# EAGLE design attiny2313devbd (EAGLE 5.06)
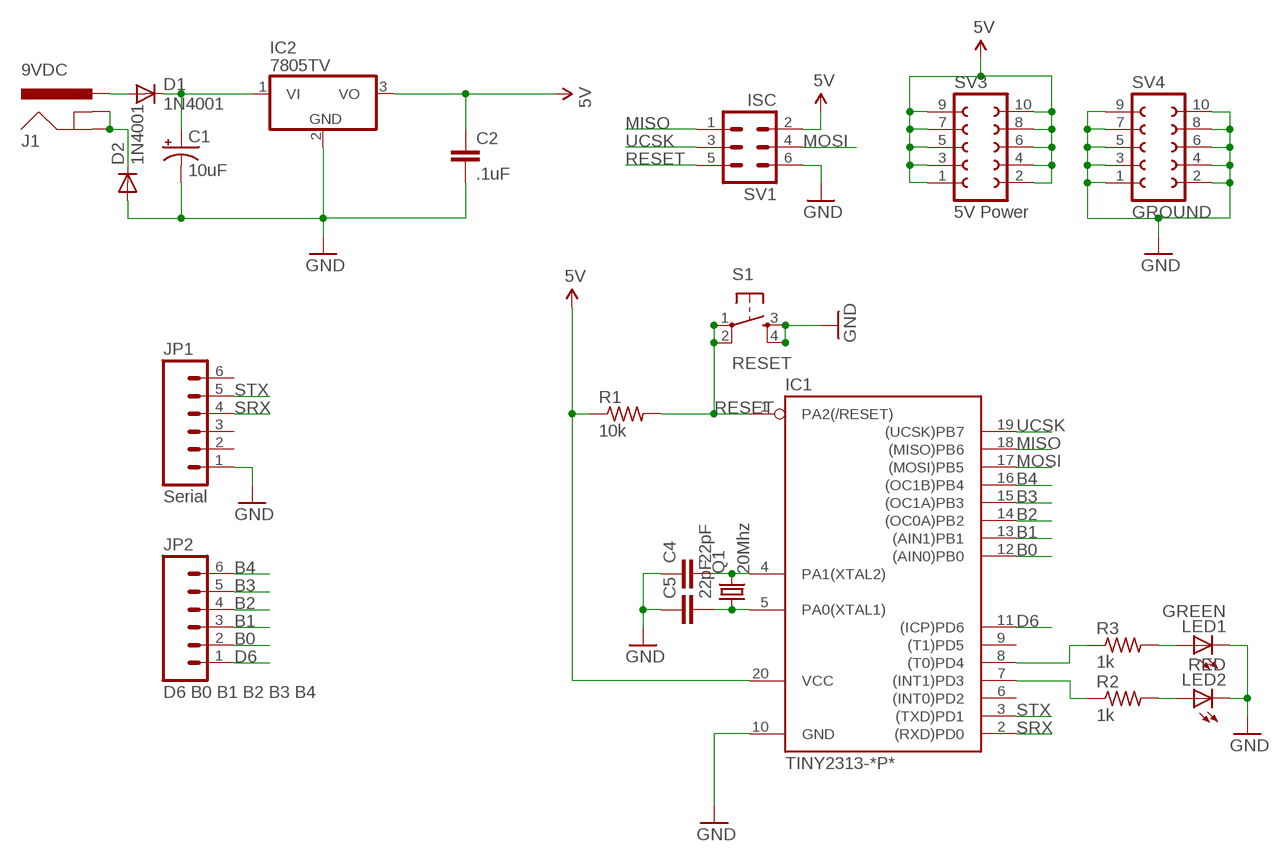
[diagram p0: schematic, sheet 1]

## Parts
C1  10uF  CAP_POLPTH2  [CPOL-RADIAL-10UF-25V]
C2  .1uF  CAPPTH2  [CAP-PTH-SMALL2]
C4  22pF  CAPPTH2  [CAP-PTH-SMALL2]
C5  22pF  CAPPTH2  [CAP-PTH-SMALL2]
D1  1N4001  DIODEPTH  [DIODE-1N4001]
D2  1N4001  DIODEPTH  [DIODE-1N4001]
IC1  TINY2313-*P*  [DIL20]
IC2  7805TV  [TO220V]
J1  9VDC  POWER_JACKPTH  [POWER_JACK_PTH]
JP1  Serial  M06SIP  [1X06]
JP2  D6 B0 B1 B2 B3 B4  M06FEMALE_LOCK  [1X06_FEMALE_LOCK.010]
LED1  GREEN  LED3MM  [LED3MM]
LED2  RED  LED3MM  [LED3MM]
Q1  20Mhz  CRYSTALHC49UV  [HC49U-V]
R1  10k  R-US_0207/10  [0207/10]
R2  1k  R-US_0207/10  [0207/10]
R3  1k  R-US_0207/10  [0207/10]
S1  RESET  TAC_SWITCHPTH  [TACTILE-PTH]
SV1  ISC  ML6  [ML6]
SV3  5V Power  FE05-2  [FE05-2]
SV4  GROUND  FE05-2  [FE05-2]

## Nets
5V: C2.1 IC1.20(VCC) IC2.3(VO) R1.1 SV1.2 SV3.1 SV3.2 SV3.3 SV3.4 SV3.5 SV3.6 SV3.7 SV3.8 SV3.9 SV3.10
B0: IC1.12((AIN0)PB0) JP2.2
B1: IC1.13((AIN1)PB1) JP2.3
B2: IC1.14((OC0A)PB2) JP2.4
B3: IC1.15((OC1A)PB3) JP2.5
B4: IC1.16((OC1B)PB4) JP2.6
D6: IC1.11((ICP)PD6) JP2.1
GND: C1.2(-) C2.2 C4.1 C5.1 D2.A IC1.10(GND) IC2.2(GND) JP1.1 LED1.K(C) LED2.K(C) S1.3 S1.4 SV1.6 SV4.1 SV4.2 SV4.3 SV4.4 SV4.5 SV4.6 SV4.7 SV4.8 SV4.9 SV4.10
MISO: IC1.18((MISO)PB6) SV1.1
MOSI: IC1.17((MOSI)PB5) SV1.4
N$1: D1.A J1.PWR
N$2: C1.1(+) D1.C IC2.1(VI)
N$3: D2.C J1.GND J1.GNDBREAK
N$4: IC1.8((T0)PD4) R3.1
N$5: IC1.7((INT1)PD3) R2.1
N$6: C4.2 IC1.4(PA1(XTAL2)) Q1.2
N$7: C5.2 IC1.5(PA0(XTAL1)) Q1.1
N$8: LED2.A R2.2
N$9: LED1.A R3.2
RESET: IC1.1(PA2(/RESET)) R1.2 S1.1 S1.2 SV1.5
SRX: IC1.2((RXD)PD0) JP1.4
STX: IC1.3((TXD)PD1) JP1.5
UCSK: IC1.19((UCSK)PB7) SV1.3
Unconnected: IC1.6((INT0)PD2) IC1.9((T1)PD5) JP1.2 JP1.3 JP1.6

## Library data of the parts
C1 = SparkFun:CAP_POL: Capacitor Polarized These are standard SMD and PTH capacitors. Normally 10uF, 47uF, and 100uF in electrolytic and tantalum varieties. Always verify the external diameter of the through hole cap, it varies with capacity, voltage, and manufacturer. The EIA devices should be standard.
C2 C4 C5 = SparkFun:CAP: Capacitor Standard 0603 ceramic capacitor, and 0.1" leaded capacitor.
D1 D2 = SparkFun:DIODE: Diode These are standard reverse protection diodes and small signal diodes. SMA package can handle up to about 1A. SOD-323 can handle about 200mA. What the SOD-323 package when ordering, there are some mfgs out there that are 5-pin packages.
IC1 = avr-6:TINY2313*: Atmel Tiny2313 2K Flash, 128 bytes EEPROM, 128 bytes RAM
IC2 = linear:78*: Positive VOLTAGE REGULATOR Source: http://cache.national.com/ds/LM/LM78L05.pdf http://www.fairchildsemi.com/ds/LM/LM7805.pdf
J1 = SparkFun:POWER_JACK: Power Jack This is the standard 5.5mm barrel jack for power. The PTH is the most common, proven, reliable, footprint. All others are experimental. The Slot footprint only works if the mill layer is transmitted to the PCB fab house so be warned. Spark Fun Electronics SKU : PRT-00119. Mating wall wart : TOL-00298 (and others)
JP1 JP2 = SparkFun:M06: Header 6 Standard 6-pin 0.1" header. Use with straight break away headers (SKU : PRT-00116), right angle break away headers (PRT-00553), swiss pins (PRT-00743), machine pins (PRT-00117), and female headers (PRT-00115). Molex polarized connector foot print use with SKU : PRT-08094 with associated crimp pins and housings. NOTES ON THE VARIANTS LOCK and LOCK_LONGPADS... This footprint was designed to help hold the alignment of a through-hole component (i.e. 6-pin header) while soldering it into place. You may notice that each hole has been shifted either up or down by 0.005 of an inch from it's more standard position (which is a perfectly straight line). This slight alteration caused the pins (the squares in the middle) to touch the edges of the holes. Because they are alternating, it causes a "brace" to hold the component in place. 0.005 has proven to be the perfect amount of "off-center" position when using our standard breakaway headers. Although looks a little odd when you look at the bare footprint, once you have a header in there, the alteration is very hard to notice. Also, if you push a header all the way into place, it is covered up entirely on the bottom side. This idea of altering the position of holes to aid alignment will be further integrated into the Sparkfun Library for other footprints. It can help hold any component with 3 or more connection pins.
LED1 LED2 = SparkFun:LED: LEDs Standard schematic elements and footprints for 5mm, 3mm, 1206, and 0603 sized LEDs. 5mm - Spark Fun Electronics SKU : COM-00529 (and others)
Q1 = SparkFun:CRYSTAL: Crystals Various standard crystals. Proven footprints. Spark Fun Electronics SKU : COM-00534
R1-R3 = resistor:R-US_: RESISTOR, American symbol
S1 = SparkFun:TAC_SWITCH: Momentary Switch Button commonly used for reset or general input. Spark Fun Electronics SKU : COM-00097
SV1 = con-harting-ml:ML6: HARTING
SV3 SV4 = con-lsta:FE05-2: FEMALE HEADER

## Board
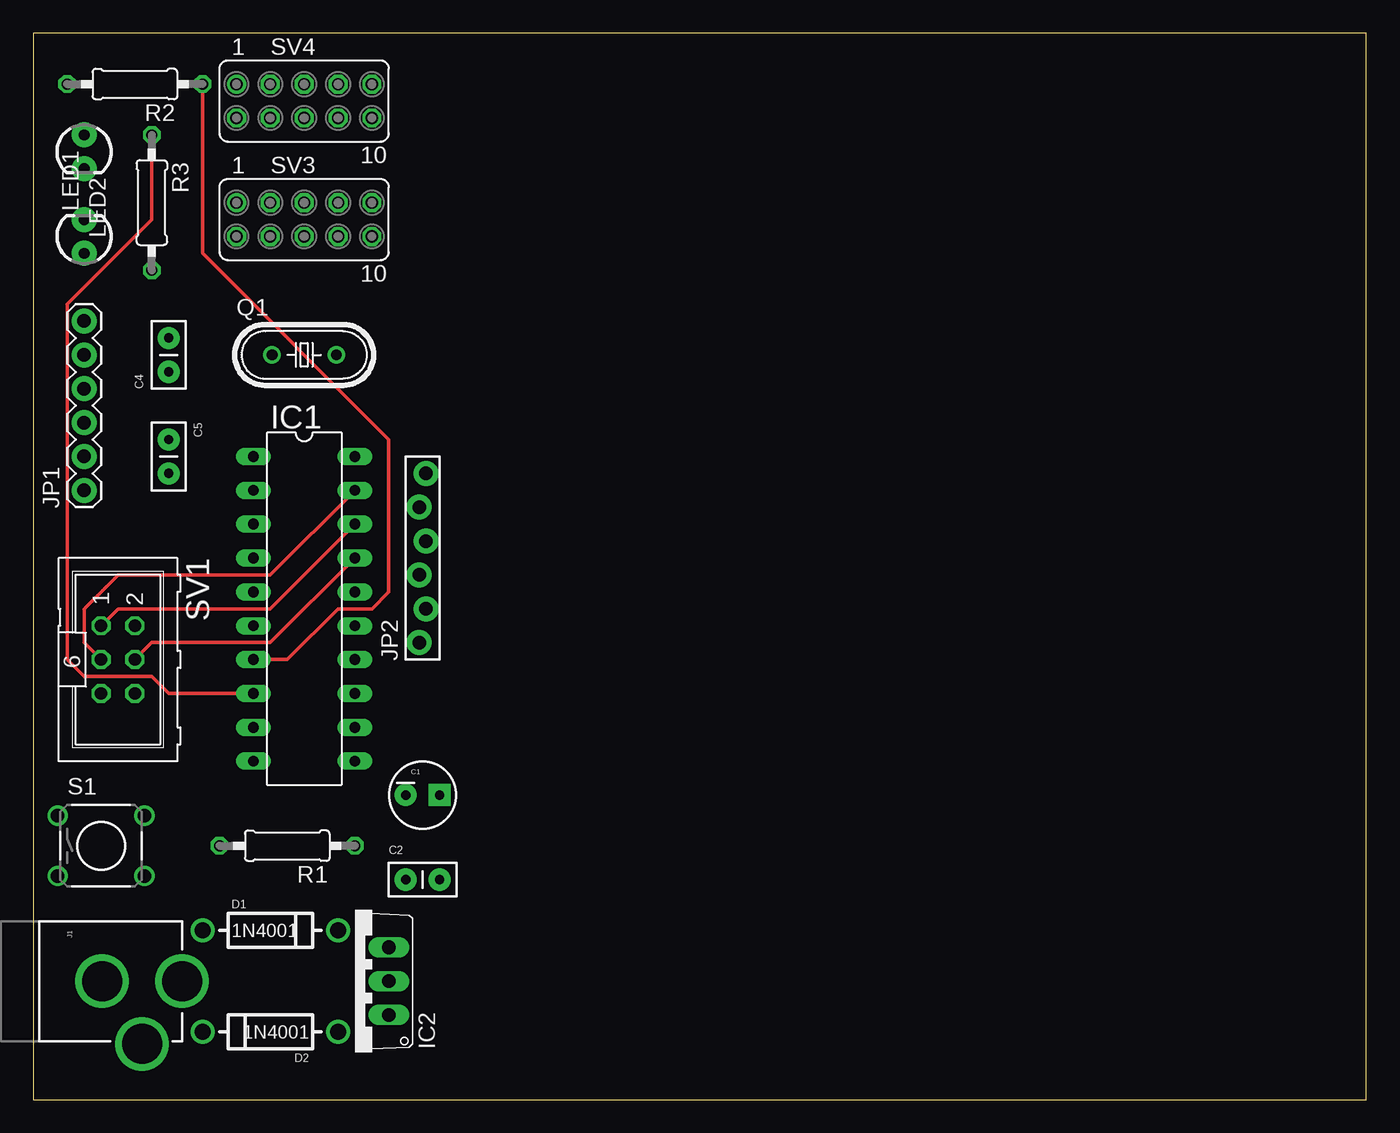
[diagram p1: board, top side]
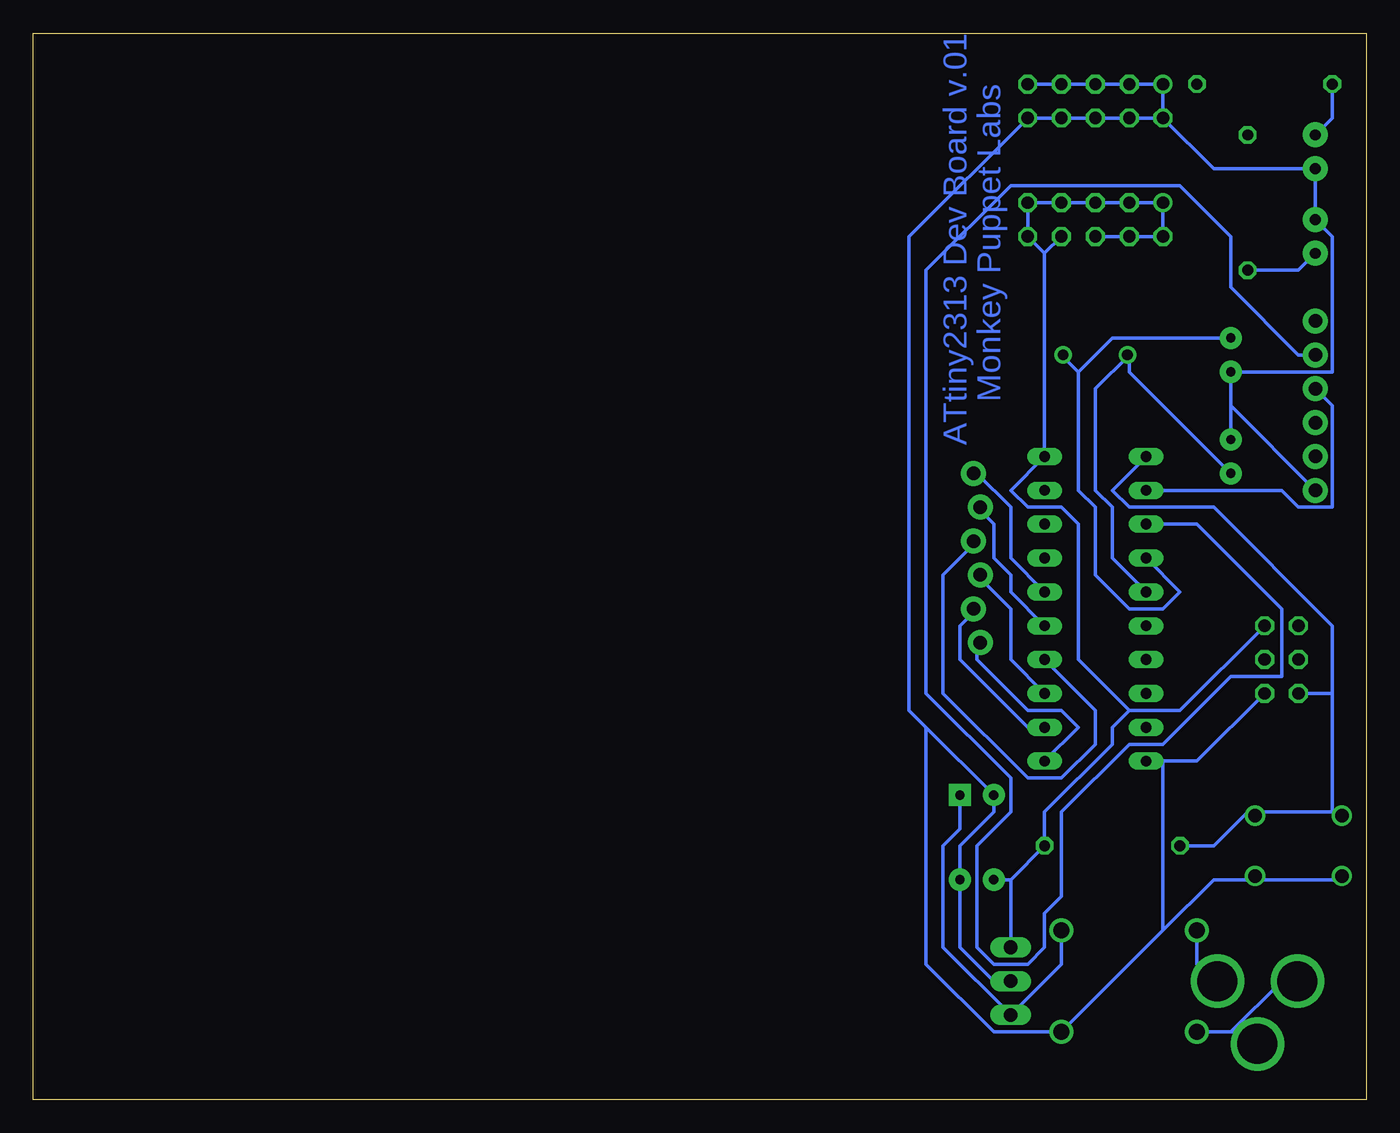
[diagram p2: board, bottom side, seen from below]

Size 100 x 80 mm. Coordinates in mm from the lower left corner, seen from the top.
Outline: 0,0 100,0 100,80 0,80 0,0
Copper layers (1*16): Top 0.035mm / dielectric 1.5mm / Bottom 0.035mm
Design rules "default": minimum track width 10mil, minimum drill 24mil, track to track 8mil, track to pad 8mil, pad to pad 8mil, via to via 8mil, smd to smd 8mil, copper to edge 40mil, drill to drill 8mil, minimum pad ring 10mil, minimum via ring 8mil, stop-mask expansion 4mil, vias tented up to drill 0mil, thermal gap 10mil

### Footprints (pad centres in the part's own frame; a part is rotated, then mirrored left to right if it is on the bottom)
CPOL-RADIAL-10UF-25V = drill 0.7 pad 1.651 square: 1 1.27,0 | drill 0.7 pad 1.651 round: 2 -1.27,0
CAP-PTH-SMALL2 = drill 0.7 pad 1.651 round: 1 0,0; 2 2.54,0
DIODE-1N4001 = drill 1.2 round: A -5.08,0; C 5.08,0
DIL20 = drill 0.813 long: 1 -11.43,-3.81; 2 -8.89,-3.81; 3 -6.35,-3.81; 4 -3.81,-3.81; 5 -1.27,-3.81; 6 1.27,-3.81; 7 3.81,-3.81; 8 6.35,-3.81; 9 8.89,-3.81; 10 11.43,-3.81; 11 11.43,3.81; 12 8.89,3.81; 13 6.35,3.81; 14 3.81,3.81; 15 1.27,3.81; 16 -1.27,3.81; 17 -3.81,3.81; 18 -6.35,3.81; 19 -8.89,3.81; 20 -11.43,3.81
TO220V = drill 1.016 long: 1 -2.54,-2.54; 2 0,-2.54; 3 2.54,-2.54
POWER_JACK_PTH = drill 2.997 round: GND 0,7.7; GNDBREAK 4.7,10.7; PWR 0,13.7
1X06 = drill 1.016 pad 1.88 round: 1 0,0; 2 2.54,0; 3 5.08,0; 4 7.62,0; 5 10.16,0; 6 12.7,0
1X06_FEMALE_LOCK.010 = drill 1.016 pad 1.88 round: 1 0,0.254; 2 2.54,-0.254; 3 5.08,0.254; 4 7.62,-0.254; 5 10.16,0.254; 6 12.7,-0.254
LED3MM = drill 0.813 pad 1.88 round: A -1.27,0; K 1.27,0
HC49U-V = drill 0.813 round: 1 -2.413,0; 2 2.413,0
0207/10 = drill 0.813 octagon: 1 -5.08,0; 2 5.08,0
TACTILE-PTH = drill 1.016 round: 1 -3.251,2.261; 2 3.251,2.261; 3 -3.251,-2.261; 4 3.251,-2.261
ML6 = drill 0.914 octagon: 1 -2.54,-1.27; 2 -2.54,1.27; 3 0,-1.27; 4 0,1.27; 5 2.54,-1.27; 6 2.54,1.27
FE05-2 = drill 0.914 round: 1 -5.08,1.27 | drill 0.914 octagon: 2 -5.08,-1.27; 3 -2.54,1.27; 4 -2.54,-1.27; 5 0,1.27; 6 0,-1.27; 7 2.54,1.27; 8 2.54,-1.27; 9 5.08,1.27; 10 5.08,-1.27

### Placement (x,y rotation side)
C1  29.21,22.86 0 top
C2  27.94,16.51 0 top
C4  10.16,54.61 90 top
C5  10.16,49.53 270 top
D1  17.78,12.7 0 top
D2  17.78,5.08 180 top
IC1  20.32,36.83 270 top
IC2  24.13,8.89 90 top
J1  -2.54,8.89 270 top
JP1  3.81,45.72 90 top
JP2  29.21,34.29 90 top
LED1  3.81,64.77 90 top
LED2  3.81,71.12 270 top
Q1  20.32,55.88 0 top
R1  19.05,19.05 180 top
R2  7.62,76.2 180 top
R3  8.89,67.31 270 top
S1  5.08,19.05 0 top
SV1  6.35,33.02 270 top
SV3  20.32,66.04 0 top
SV4  20.32,74.93 0 top

### Tracks (layer width: path | path; a pad name or v marks a point on that pad's centre or on a via)
5V
  Bottom 0.254: SV3.6 SV3.4 SV3.2 SV3.1 SV3.3 SV3.5 SV3.7 SV3.9 SV3.10 24.13,63.5 | 24.13,63.5 IC1.20 26.67,45.72 25.4,44.45 22.86,44.45 21.59,43.18 21.59,33.02 17.78,29.21 | 24.13,63.5 SV3.8 | 26.67,16.51 R1.1 24.13,21.59 19.05,26.67 19.05,27.94 17.78,29.21 | 26.67,16.51 C2.1 | SV1.2 13.97,29.21 17.78,29.21 | IC2.3 26.67,16.51
B0
  Bottom 0.254: IC1.12 25.4,27.94 30.48,33.02 30.48,35.56 29.21,36.83 JP2.2
B1
  Bottom 0.254: IC1.13 26.67,33.02 26.67,36.83 29.21,39.37 JP2.3
B2
  Bottom 0.254: IC1.14 20.32,29.21 20.32,26.67 22.86,24.13 25.4,24.13 31.75,30.48 31.75,39.37 29.21,41.91 JP2.4
B3
  Bottom 0.254: IC1.15 26.67,38.1 26.67,39.37 27.94,40.64 27.94,43.18 29.21,44.45 JP2.5
B4
  Bottom 0.254: IC1.16 26.67,40.64 26.67,44.45 29.21,46.99 JP2.6
D6
  Bottom 0.254: IC1.11 21.59,27.94 22.86,29.21 25.4,29.21 29.21,33.02 29.21,34.29 JP2.1
GND
  Bottom 0.254: 15.24,25.4 12.7,25.4 SV1.6 | S1.3 2.54,16.51 7.62,16.51 S1.4 8.89,16.51 11.43,16.51 15.24,12.7 | 15.24,12.7 D2.A 27.94,5.08 33.02,10.16 33.02,27.94 | 15.24,12.7 15.24,25.4 | 15.24,25.4 IC1.10 | IC2.2 27.94,8.89 30.48,11.43 C2.2 30.48,19.05 27.94,21.59 C1.2 33.02,27.94 | 10.16,52.07 C4.1 2.54,54.61 2.54,64.77 LED1.K LED2.K 11.43,69.85 SV4.2 | 10.16,52.07 C5.1 | 10.16,52.07 JP1.1 | SV4.2 SV4.1 SV4.3 SV4.5 SV4.7 SV4.9 | SV4.2 SV4.4 SV4.6 SV4.8 SV4.10 34.29,64.77 34.29,29.21 33.02,27.94
MISO
  Top 0.254: IC1.18 17.78,36.83 6.35,36.83 SV1.1
MOSI
  Top 0.254: IC1.17 17.78,34.29 8.89,34.29 SV1.4
N$1
  Bottom 0.254: D1.A 12.7,10.16 11.43,8.89 J1.PWR
N$2
  Bottom 0.254: D1.C 22.86,10.16 IC2.1 31.75,11.43 31.75,19.05 30.48,20.32 C1.1
N$3
  Bottom 0.254: 10.16,5.08 8.89,5.08 J1.GNDBREAK | 10.16,5.08 D2.C | 10.16,5.08 6.35,8.89 J1.GND
N$4
  Top 0.254: IC1.8 10.16,30.48 8.89,31.75 3.81,31.75 2.54,33.02 2.54,59.69 8.89,66.04 R3.1
N$5
  Top 0.254: IC1.7 19.05,33.02 22.86,36.83 25.4,36.83 26.67,38.1 26.67,49.53 12.7,63.5 R2.1
N$6
  Bottom 0.254: IC1.4 13.97,38.1 15.24,36.83 17.78,36.83 20.32,39.37 20.32,44.45 21.59,45.72 21.59,54.61 | 21.59,54.61 22.86,55.88 Q1.2 | C4.2 19.05,57.15 21.59,54.61
N$7
  Bottom 0.254: IC1.5 19.05,40.64 19.05,44.45 20.32,45.72 20.32,53.34 17.78,55.88 | C5.2 17.78,54.61 17.78,55.88 | 17.78,55.88 Q1.1
N$8
  Bottom 0.254: R2.2 2.54,73.66 LED2.A
N$9
  Bottom 0.254: R3.2 5.08,62.23 LED1.A
RESET
  Bottom 0.254: R1.2 11.43,19.05 8.89,21.59 S1.2 7.62,21.59 2.54,21.59 | IC1.1 19.05,45.72 17.78,44.45 11.43,44.45 2.54,35.56 2.54,30.48 | 2.54,21.59 2.54,30.48 | 2.54,30.48 SV1.5 | S1.1 2.54,21.59
SRX
  Bottom 0.254: IC1.2 6.35,45.72 5.08,44.45 2.54,44.45 2.54,52.07 JP1.4
STX
  Bottom 0.254: IC1.3 12.7,43.18 6.35,36.83 6.35,31.75 10.16,31.75 15.24,26.67 17.78,26.67 22.86,21.59 22.86,15.24 24.13,13.97 24.13,11.43 25.4,10.16 27.94,10.16 29.21,11.43 29.21,19.05 26.67,21.59 26.67,24.13 33.02,30.48 33.02,62.23 26.67,68.58 13.97,68.58 10.16,64.77 10.16,60.96 5.08,55.88 JP1.5
UCSK
  Top 0.254: IC1.19 17.78,39.37 6.35,39.37 3.81,36.83 3.81,34.29 SV1.3

### Text on the board
Bottom: ATtiny2313 Dev Board v.01 | Monkey Puppet Labs